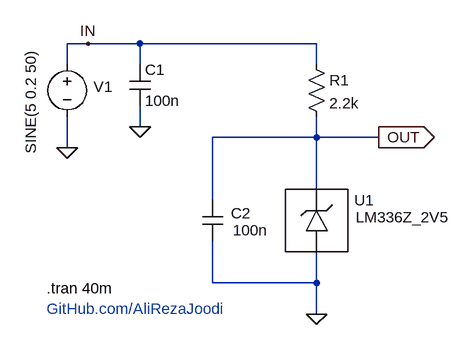
[diagram p0: schematic v2.0.asc]
v2.0.asc, the LTspice schematic file:
Version 4.1
SHEET 1 880 680
WIRE -16 -48 -48 -48
WIRE 64 -48 -16 -48
WIRE 336 -48 64 -48
WIRE -48 -16 -48 -48
WIRE 64 -16 64 -48
WIRE 336 -16 336 -48
WIRE 64 80 64 48
WIRE 336 96 336 64
WIRE 336 96 176 96
WIRE 432 96 336 96
WIRE -48 112 -48 64
WIRE 336 176 336 96
WIRE 176 192 176 96
WIRE 176 320 176 256
WIRE 336 320 336 272
WIRE 336 320 176 320
WIRE 336 368 336 320
FLAG 336 368 0
FLAG -48 112 0
FLAG 432 96 OUT
IOPIN 432 96 Out
FLAG 64 80 0
FLAG -16 -48 IN
SYMBOL voltage -48 -32 R0
WINDOW 0 41 50 Left 2
WINDOW 3 -56 -6 VRight 2
WINDOW 123 0 0 Left 0
WINDOW 39 0 0 Left 0
SYMATTR InstName V1
SYMATTR Value SINE(5 0.2 50)
SYMBOL res 320 -32 R0
SYMATTR InstName R1
SYMATTR Value 2.2k
SYMBOL cap 160 192 R0
WINDOW 0 44 21 Left 2
WINDOW 3 47 47 Left 2
SYMATTR InstName C2
SYMATTR Value 100n
SYMBOL cap 48 -16 R0
SYMATTR InstName C1
SYMATTR Value 100n
SYMBOL MyLib\\Regulator_Linear\\LM336Z_2V5 336 224 M0
WINDOW 0 -89 -31 Left 2
WINDOW 38 -206 -5 Left 2
SYMATTR InstName U1
TEXT -80 328 Left 2 !.tran 40m
TEXT -80 360 Left 2 ;GitHub.com/AliRezaJoodi

The netlist it stands for:
* v2.0.asc
V1 IN 0 SINE(5 0.2 50)
R1 IN OUT 2.2k
C2 OUT 0 100n
C1 IN 0 100n
X§U1 0 OUT LM336Z_2V5  ; pins ANODE CATHODE
.tran 40m
* GitHub.com/AliRezaJoodi
.lib MyLib/Regulator_Linear/LM336Z_2V5.lib
.backanno
.end